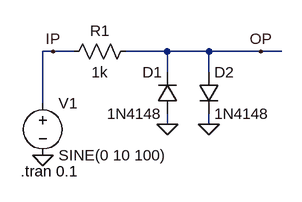
[diagram p0: schematic fft.asc]
fft.asc, the LTspice schematic file:
Version 4
SHEET 1 880 680
WIRE 64 64 48 64
WIRE 96 64 64 64
WIRE 240 64 176 64
WIRE 304 64 240 64
WIRE 384 64 304 64
WIRE 416 64 384 64
WIRE 240 96 240 64
WIRE 304 96 304 64
WIRE 48 144 48 64
WIRE 240 176 240 160
WIRE 304 176 304 160
FLAG 48 224 0
FLAG 240 176 0
FLAG 304 176 0
FLAG 384 64 OP
FLAG 64 64 IP
SYMBOL voltage 48 128 R0
WINDOW 123 0 0 Left 0
WINDOW 39 0 0 Left 0
SYMATTR InstName V1
SYMATTR Value SINE(0 10 100)
SYMBOL diode 256 160 R180
WINDOW 0 24 64 Left 2
WINDOW 3 24 0 Left 2
SYMATTR InstName D1
SYMATTR Value 1N4148
SYMBOL diode 288 96 R0
SYMATTR InstName D2
SYMATTR Value 1N4148
SYMBOL res 192 48 R90
WINDOW 0 0 56 VBottom 2
WINDOW 3 32 56 VTop 2
SYMATTR InstName R1
SYMATTR Value 1k
TEXT 14 248 Left 2 !.tran 0.1

The netlist it stands for:
* fft.asc
V1 IP 0 SINE(0 10 100)
D1 0 OP 1N4148
D2 OP 0 1N4148
R1 OP IP 1k
.model D D
.lib standard.dio
.tran 0.1
.backanno
.end

* Results of the author's LTspice run, read from the files saved beside the schematic
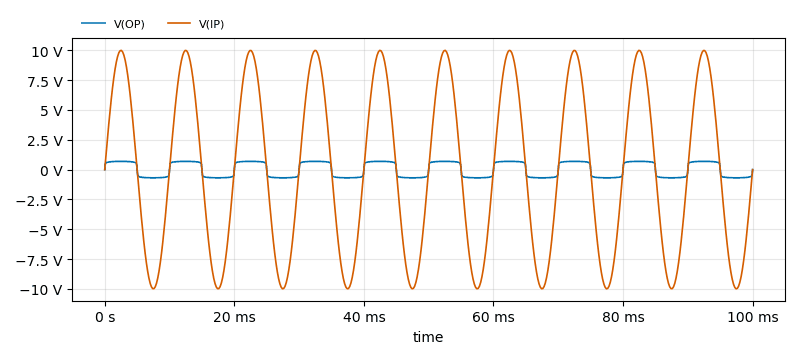
[diagram p1: Transient Analysis of fft.asc, plotted from the saved traces]
* Transient Analysis, 1 run:
*   V(OP): min -690.5 mV, max 690.5 mV, average -21.06 µV, rms 648.8 mV, last -54.43 µV
*   V(IP): min -9.994 V, max 9.995 V, average 0 V, rms 7.068 V, last 0 V